# EAGLE design laugh_cry_gold (EAGLE 9.5.2)
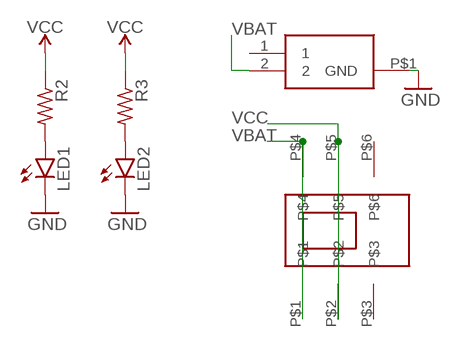
[diagram p0: schematic, sheet 1]

## Parts
LED1  LEDCHIP-LED0805  [CHIP-LED0805]
LED2  LEDCHIP-LED0805  [CHIP-LED0805]
R2  R-US_R0603  [R0603]
R3  R-US_R0603  [R0603]
U$1  CL-SB-22A-02T-SLIDE-SWITCH-TUCKED-PADS  [CL-SB-22A-02T-DPDT-COMPACT-SWITCH]
VBAT  BAT-HLD-012-SMT  [BATHLD012SMT]

## Nets
GND: LED1.C LED2.C VBAT.P$1(GND)
N$1: LED1.A R2.2
N$2: LED2.A R3.2
VBAT: U$1.P$1 U$1.P$4 VBAT.2
VCC: R2.1 R3.1 U$1.P$2 U$1.P$5
Unconnected: U$1.P$3 U$1.P$6 VBAT.1

## Library data of the parts
LED1 LED2 = led:LED: LED OSRAM: - CHIPLED LG R971, LG N971, LY N971, LG Q971, LY Q971, LO R971, LY R971 LH N974, LH R974 LS Q976, LO Q976, LY Q976 LO Q996 - Hyper CHIPLED LW Q18S LB Q993, LB Q99A, LB R99A - SideLED LS A670, LO A670, LY A670, LG A670, LP A670 LB A673, LV A673, LT A673, LW A673 LH A674 LY A675 LS A676, LA A676, LO A676, LY A676, LW A676 LS A679, LY A679, LG A679 - Hyper Micro SIDELED® LS Y876, LA Y876, LO Y876, LY Y876 LT Y87S - SmartLED LW L88C, LW L88S LB L89C, LB L89S, LG L890 LS L89K, LO L89K, LY L89K LS L896, LA L896, LO L896, LY L896 - TOPLED LS T670, LO T670, LY T670, LG T670, LP T670 LSG T670, LSP T670, LSY T670, LOP T670, LYG T670 LG T671, LOG T671, LSG T671 LB T673, LV T673, LT T673, LW T673 LH T674 LS T676, LA T676, LO T676, LY T676, LB T676, LH T676, LSB T676, LW T676 LB T67C, LV T67C, LT T67C, LS T67K, LO T67K, LY T67K, LW E67C LS E67B, LA E67B, LO E67B, LY E67B, LB E67C, LV E67C, LT E67C LW T67C LS T679, LY T679, LG T679 LS T770, LO T770, LY T770, LG T770, LP T770 LB T773, LV T773, LT T773, LW T773 LH T774 LS E675, LA E675, LY E675, LS T675 LS T776, LA T776, LO T776, LY T776, LB T776 LHGB T686 LT T68C, LB T68C - Hyper Mini TOPLED® LB M676 - Mini TOPLED Santana® LG M470 LS M47K, LO M47K, LY M47K Source: http://www.osram.convergy.de LUXEON: - LUMILED® LXK2-PW12-R00, LXK2-PW12-S00, LXK2-PW14-U00, LXK2-PW14-V00 LXK2-PM12-R00, LXK2-PM12-S00, LXK2-PM14-U00 LXK2-PE12-Q00, LXK2-PE12-R00, LXK2-PE12-S00, LXK2-PE14-T00, LXK2-PE14-U00 LXK2-PB12-K00, LXK2-PB12-L00, LXK2-PB12-M00, LXK2-PB14-N00, LXK2-PB14-P00, LXK2-PB14-Q00 LXK2-PR12-L00, LXK2-PR12-M00, LXK2-PR14-Q00, LXK2-PR14-R00 LXK2-PD12-Q00, LXK2-PD12-R00, LXK2-PD12-S00 LXK2-PH12-R00, LXK2-PH12-S00 LXK2-PL12-P00, LXK2-PL12-Q00, LXK2-PL12-R00 Source: www.luxeon.com KINGBRIGHT: KA-3528ASYC Source: www.kingbright.com
R2 R3 = rcl:R-US_: RESISTOR, American symbol; SPICEPREFIX: R
U$1 = electroninks:CL-SB-22A-02T-SLIDE-SWITCH-TUCKED-PADS
VBAT = SamacSys_Parts:BAT-HLD-012-SMT: Coin Cell Battery Holders Bat Hld CR1216/1225 Surface Mount Source: Datasheet <https://componentsearchengine.com/Datasheets/1/BAT-HLD-012-SMT.pdf>; DESCRIPTION: Coin Cell Battery Holders Bat Hld CR1216/1225 Surface Mount; HEIGHT: 3mm; MANUFACTURER_NAME: Linx Technologies; MANUFACTURER_PART_NUMBER: BAT-HLD-012-SMT; MOUSER_PART_NUMBER: 712-BAT-HLD-012-SMT; MOUSER_PRICE-STOCK: https://www.mouser.com/Search/Refine.aspx?Keyword=712-BAT-HLD-012-SMT

## Board
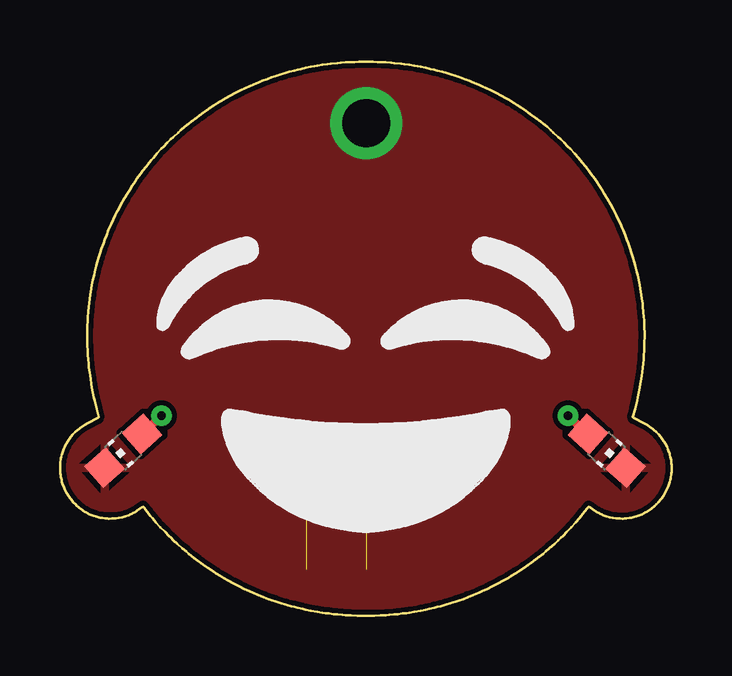
[diagram p1: board, top side]
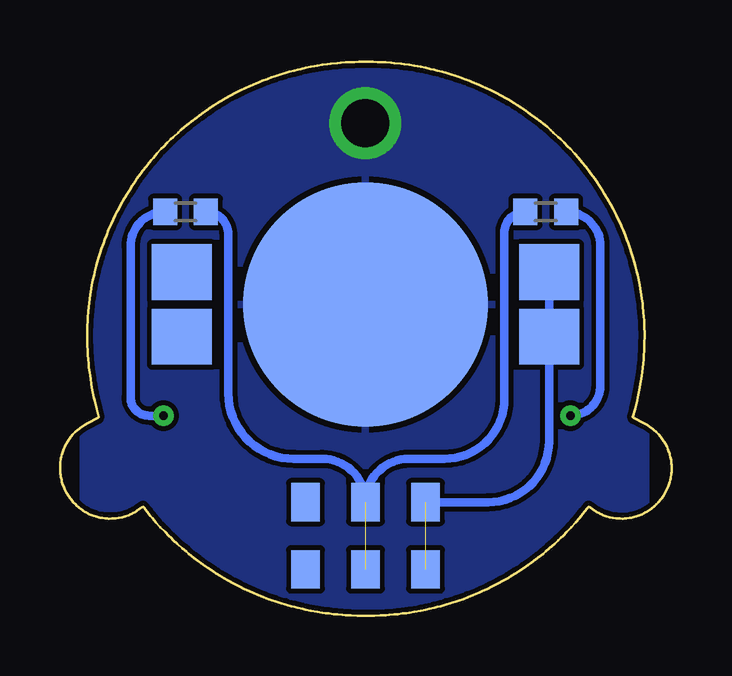
[diagram p2: board, bottom side, seen from below]

Size 25.49 x 23.09 mm. Coordinates in mm from the lower left corner, seen from the top.
Outline: 12.74,0 12.39,0 12.11,0.01 11.9,0.02 11.77,0.03 11.56,0.05 11.42,0.06 11.21,0.09 11.07,0.11 10.93,0.12 10.72,0.16 10.45,0.21 10.24,0.25 10.11,0.28 9.9,0.33 9.77,0.36 9.63,0.39 9.43,0.45 9.16,0.53 8.96,0.6 8.83,0.64 8.7,0.69 8.5,0.76 8.24,0.87 8.04,0.95 7.92,1 7.66,1.12 7.47,1.22 7.35,1.28 7.22,1.34 7.04,1.44 6.8,1.58 6.68,1.66 6.5,1.77 6.38,1.84 6.15,2 5.97,2.12 5.86,2.2 5.75,2.28 5.58,2.41 5.36,2.58 5.25,2.67 5.09,2.81 4.88,3 4.73,3.14 4.63,3.24 4.53,3.33 4.38,3.48 4.19,3.69 4,3.9 3.86,4.05 3.77,4.16 3.64,4.33 3.51,4.49 3.46,4.53 3.4,4.5 3.29,4.42 3.23,4.38 3.17,4.34 3.11,4.31 3.05,4.27 2.98,4.24 2.92,4.21 2.86,4.19 2.72,4.14 2.59,4.1 2.45,4.07 2.31,4.05 2.24,4.05 2.17,4.04 2.03,4.04 1.96,4.05 1.89,4.05 1.76,4.07 1.69,4.08 1.62,4.09 1.55,4.11 1.48,4.13 1.42,4.15 1.35,4.18 1.29,4.2 1.22,4.23 1.16,4.26 1.1,4.29 1.04,4.33 0.98,4.37 0.92,4.4 0.86,4.45 0.81,4.49 0.75,4.53 0.7,4.58 0.65,4.63 0.55,4.73 0.46,4.84 0.42,4.89 0.38,4.95 0.34,5.01 0.27,5.13 0.21,5.25 0.15,5.38 0.13,5.45 0.1,5.52 0.08,5.58 0.06,5.65 0.05,5.72 0.03,5.79 0.02,5.86 0.01,5.93 0.01,6 0,6.07 0,6.14 0,6.21 0,6.28 0.01,6.35 0.02,6.42 0.03,6.49 0.04,6.56 0.05,6.63 0.07,6.69 0.09,6.76 0.11,6.83 0.14,6.89 0.16,6.96 0.19,7.02 0.22,7.09 0.26,7.15 0.33,7.27 0.41,7.38 0.45,7.44 0.54,7.55 0.64,7.65 0.74,7.74 0.79,7.79 0.85,7.83 0.91,7.87 1.02,7.95 1.14,8.02 1.58,8.24 1.61,8.29 1.52,8.63 1.44,8.97 1.41,9.11 1.37,9.31 1.33,9.52 1.3,9.66 1.27,9.87 1.25,10 1.23,10.14 1.21,10.35 1.19,10.49 1.17,10.7 1.16,10.84 1.15,11.05 1.14,11.26 1.14,11.4 1.13,11.62 1.13,11.76 1.14,12.04 1.15,12.32 1.16,12.46 1.18,12.67 1.2,12.88 1.21,13.02 1.24,13.23 1.26,13.37 1.31,13.64 1.33,13.78 1.37,13.99 1.42,14.2 1.45,14.33 1.52,14.6 1.56,14.74 1.62,14.94 1.68,15.14 1.72,15.28 1.82,15.54 1.86,15.67 1.94,15.87 2.02,16.07 2.08,16.2 2.13,16.32 2.22,16.52 2.31,16.7 2.38,16.83 2.44,16.96 2.54,17.14 2.68,17.39 2.82,17.63 2.9,17.75 3.01,17.92 3.13,18.1 3.21,18.21 3.37,18.44 3.46,18.55 3.59,18.72 3.72,18.88 3.81,18.99 3.9,19.1 4.04,19.26 4.23,19.46 4.32,19.56 4.47,19.71 4.62,19.86 4.72,19.96 4.93,20.15 5.03,20.24 5.19,20.38 5.36,20.51 5.47,20.6 5.69,20.77 5.8,20.85 5.97,20.98 6.09,21.06 6.26,21.17 6.44,21.29 6.56,21.36 6.8,21.51 6.92,21.58 7.1,21.68 7.29,21.78 7.41,21.84 7.54,21.91 7.73,22 7.92,22.08 8.04,22.14 8.3,22.25 8.43,22.3 8.63,22.37 8.83,22.45 8.96,22.49 9.23,22.58 9.36,22.62 9.56,22.67 9.77,22.73 9.9,22.76 10.04,22.79 10.24,22.84 10.45,22.88 10.59,22.91 10.72,22.93 10.93,22.96 11.14,22.99 11.28,23.01 11.56,23.04 11.7,23.05 11.9,23.07 12.04,23.07 12.25,23.08 12.46,23.09 12.77,23.09 13.02,23.09 13.23,23.08 13.44,23.07 13.58,23.07 13.79,23.05 13.93,23.04 14.21,23.01 14.35,22.99 14.56,22.96 14.76,22.93 14.9,22.91 15.04,22.88 15.25,22.84 15.45,22.79 15.59,22.76 15.72,22.73 15.93,22.67 16.13,22.62 16.26,22.58 16.53,22.49 16.66,22.45 16.86,22.37 17.05,22.3 17.19,22.25 17.44,22.14 17.57,22.08 17.76,22 17.95,21.91 18.08,21.84 18.2,21.78 18.39,21.68 18.57,21.58 18.69,21.51 18.93,21.36 19.05,21.29 19.23,21.17 19.4,21.06 19.52,20.98 19.69,20.85 19.8,20.77 20.02,20.6 20.13,20.51 20.29,20.38 20.45,20.24 20.56,20.15 20.76,19.96 20.87,19.86 21.02,19.71 21.16,19.56 21.26,19.46 21.45,19.26 21.59,19.1 21.68,18.99 21.77,18.88 21.9,18.72 22.03,18.55 22.11,18.44 22.28,18.21 22.36,18.1 22.48,17.92 22.59,17.75 22.67,17.63 22.81,17.39 22.95,17.14 23.05,16.96 23.11,16.83 23.18,16.7 23.27,16.52 23.36,16.32 23.41,16.2 23.47,16.07 23.55,15.87 23.62,15.67 23.67,15.54 23.76,15.28 23.81,15.14 23.87,14.94 23.93,14.74 23.97,14.6 24.04,14.33 24.07,14.2 24.11,13.99 24.15,13.78 24.18,13.64 24.23,13.37 24.25,13.23 24.27,13.02 24.29,12.88 24.31,12.67 24.33,12.46 24.34,12.32 24.35,12.04 24.36,11.76 24.36,11.62 24.35,11.4 24.35,11.26 24.34,11.05 24.33,10.84 24.31,10.7 24.3,10.49 24.28,10.35 24.26,10.14 24.24,10 24.22,9.87 24.18,9.66 24.16,9.52 24.12,9.31 24.08,9.11 24.05,8.97 23.97,8.63 23.88,8.29 23.91,8.24 24.34,8.02 24.46,7.95 24.58,7.87 24.64,7.83 24.69,7.79 24.75,7.74 24.85,7.65 24.95,7.55 25.04,7.44 25.08,7.38 25.16,7.27 25.23,7.15 25.27,7.09 25.3,7.02 25.32,6.96 25.35,6.89 25.38,6.83 25.4,6.76 25.42,6.69 25.43,6.63 25.45,6.56 25.46,6.49 25.47,6.42 25.48,6.35 25.48,6.28 25.49,6.21 25.49,6.14 25.49,6.07 25.48,6 25.47,5.93 25.46,5.86 25.45,5.79 25.44,5.72 25.42,5.65 25.41,5.58 25.39,5.52 25.36,5.45 25.34,5.38 25.28,5.25 25.22,5.13 25.15,5.01 25.11,4.95 25.07,4.89 25.03,4.84 24.94,4.73 24.84,4.63 24.79,4.58 24.74,4.53 24.68,4.49 24.63,4.45 24.57,4.4 24.51,4.37 24.45,4.33 24.39,4.29 24.33,4.26 24.27,4.23 24.2,4.2 24.14,4.18 24.07,4.15 24,4.13 23.94,4.11 23.87,4.09 23.8,4.08 23.73,4.07 23.59,4.05 23.52,4.05 23.45,4.04 23.31,4.04 23.24,4.05 23.17,4.05 23.04,4.07 22.9,4.1 22.76,4.14 22.63,4.19 22.57,4.21 22.5,4.24 22.44,4.27 22.38,4.31 22.32,4.34 22.26,4.38 22.2,4.42 22.09,4.5 22.03,4.53 21.98,4.49 21.85,4.33 21.72,4.16 21.63,4.05 21.49,3.9 21.3,3.69 21.11,3.48 20.96,3.33 20.86,3.24 20.76,3.14 20.6,3 20.4,2.81 20.24,2.67 20.13,2.58 19.91,2.41 19.74,2.28 19.63,2.2 19.51,2.12 19.34,2 19.11,1.84 18.99,1.77 18.81,1.66 18.69,1.58 18.45,1.44 18.26,1.34 18.14,1.28 18.01,1.22 17.83,1.12 17.57,1 17.44,0.95 17.25,0.87 16.99,0.76 16.79,0.69 16.66,0.64 16.53,0.6 16.33,0.53 16.06,0.45 15.86,0.39 15.72,0.36 15.59,0.33 15.38,0.28 15.25,0.25 15.04,0.21 14.76,0.16 14.56,0.12 14.42,0.11 14.28,0.09 14.07,0.06 13.93,0.05 13.72,0.03 13.58,0.02 13.37,0.01 13.09,0 12.74,0
Copper layers (1*16): Top 0.035mm / dielectric 1.5mm / Bottom 0.035mm
Design rules "SparkFun *": minimum track width 8mil, minimum drill 20mil, track to track 8mil, track to pad 8mil, pad to pad 8mil, via to via 8mil, smd to smd 8mil, copper to edge 8mil, drill to drill 8mil, minimum pad ring 12mil, minimum via ring 10mil, stop-mask expansion 4mil, vias tented up to drill 0.4mm, thermal gap 10mil

### Footprints (pad centres in the part's own frame; a part is rotated, then mirrored left to right if it is on the bottom)
CHIP-LED0805 = smd 1.2 x 1.2: A 0,-1.05; C 0,1.05
R0603 = smd 1 x 1.1: 1 -0.85,0; 2 0.85,0
CL-SB-22A-02T-DPDT-COMPACT-SWITCH = smd 1.2 x 1.6: P$1 -2.5,-1.4; P$2 0,-1.4; P$3 2.5,-1.4; P$4 -2.5,1.4; P$5 0,1.4; P$6 2.5,1.4
BATHLD012SMT = smd 2.5 x 2.325: 1 -7.65,1.35; 2 7.65,1.35; P$2 -7.65,-1.35; P$3 7.65,-1.35 | smd 10.2 x 10.2: P$1 0,0

### Placement (x,y rotation side)
LED1  2.64,6.87 132 top
LED2  22.78,6.87 228 top
R2  5.25,16.84 0 bottom
R3  20.26,16.84 180 bottom
U$1  12.76,3.33 180 bottom
VBAT  12.76,12.97 0 bottom

### Tracks (layer width: path | path; a pad name or v marks a point on that pad's centre or on a via)
GND  (via drill 2)
  other vias: 12.76,20.54
  pour Bottom: 1.08,23.64 24.51,23.64 24.51,-1.46 1.08,-1.46
  pour Top (rank 3): 2.47,-1.46 -2.03,-1.46 -2.03,17.54 -2.03,26.04 26.47,26.04 27.47,26.04 27.47,-1.46
N$1  (via drill 0.35)
  Top 0.35: LED1.A v4.22,8.34
  Bottom 0.35: R2.2 arc90 2.97,15.41 2.97,9.59 arc90 v4.22,8.34
N$2  (via drill 0.35)
  Top 0.35: LED2.A 21.99,7.57 v21.17,8.34
  Bottom 0.35: R3.2 arc-90 22.55,15.4 22.55,9.11 arc-90 21.77,8.34 v21.17,8.34
VBAT  (1 unrouted)
  Bottom 0.35: U$1.P$1 7.65,4.73 arc-90 5.11,7.27 VBAT.2
VCC  (1 unrouted)
  Bottom 0.35: R3.1 arc90 18.47,15.9 18.47,9.27 arc-90 15.74,6.54 14.57,6.54 arc90 U$1.P$2 arc90 10.96,6.54 9.47,6.54 arc-90 6.97,9.04 6.97,15.96 arc90 R2.1